# EAGLE schematic Learing_scheme (EAGLE 9.6.2)
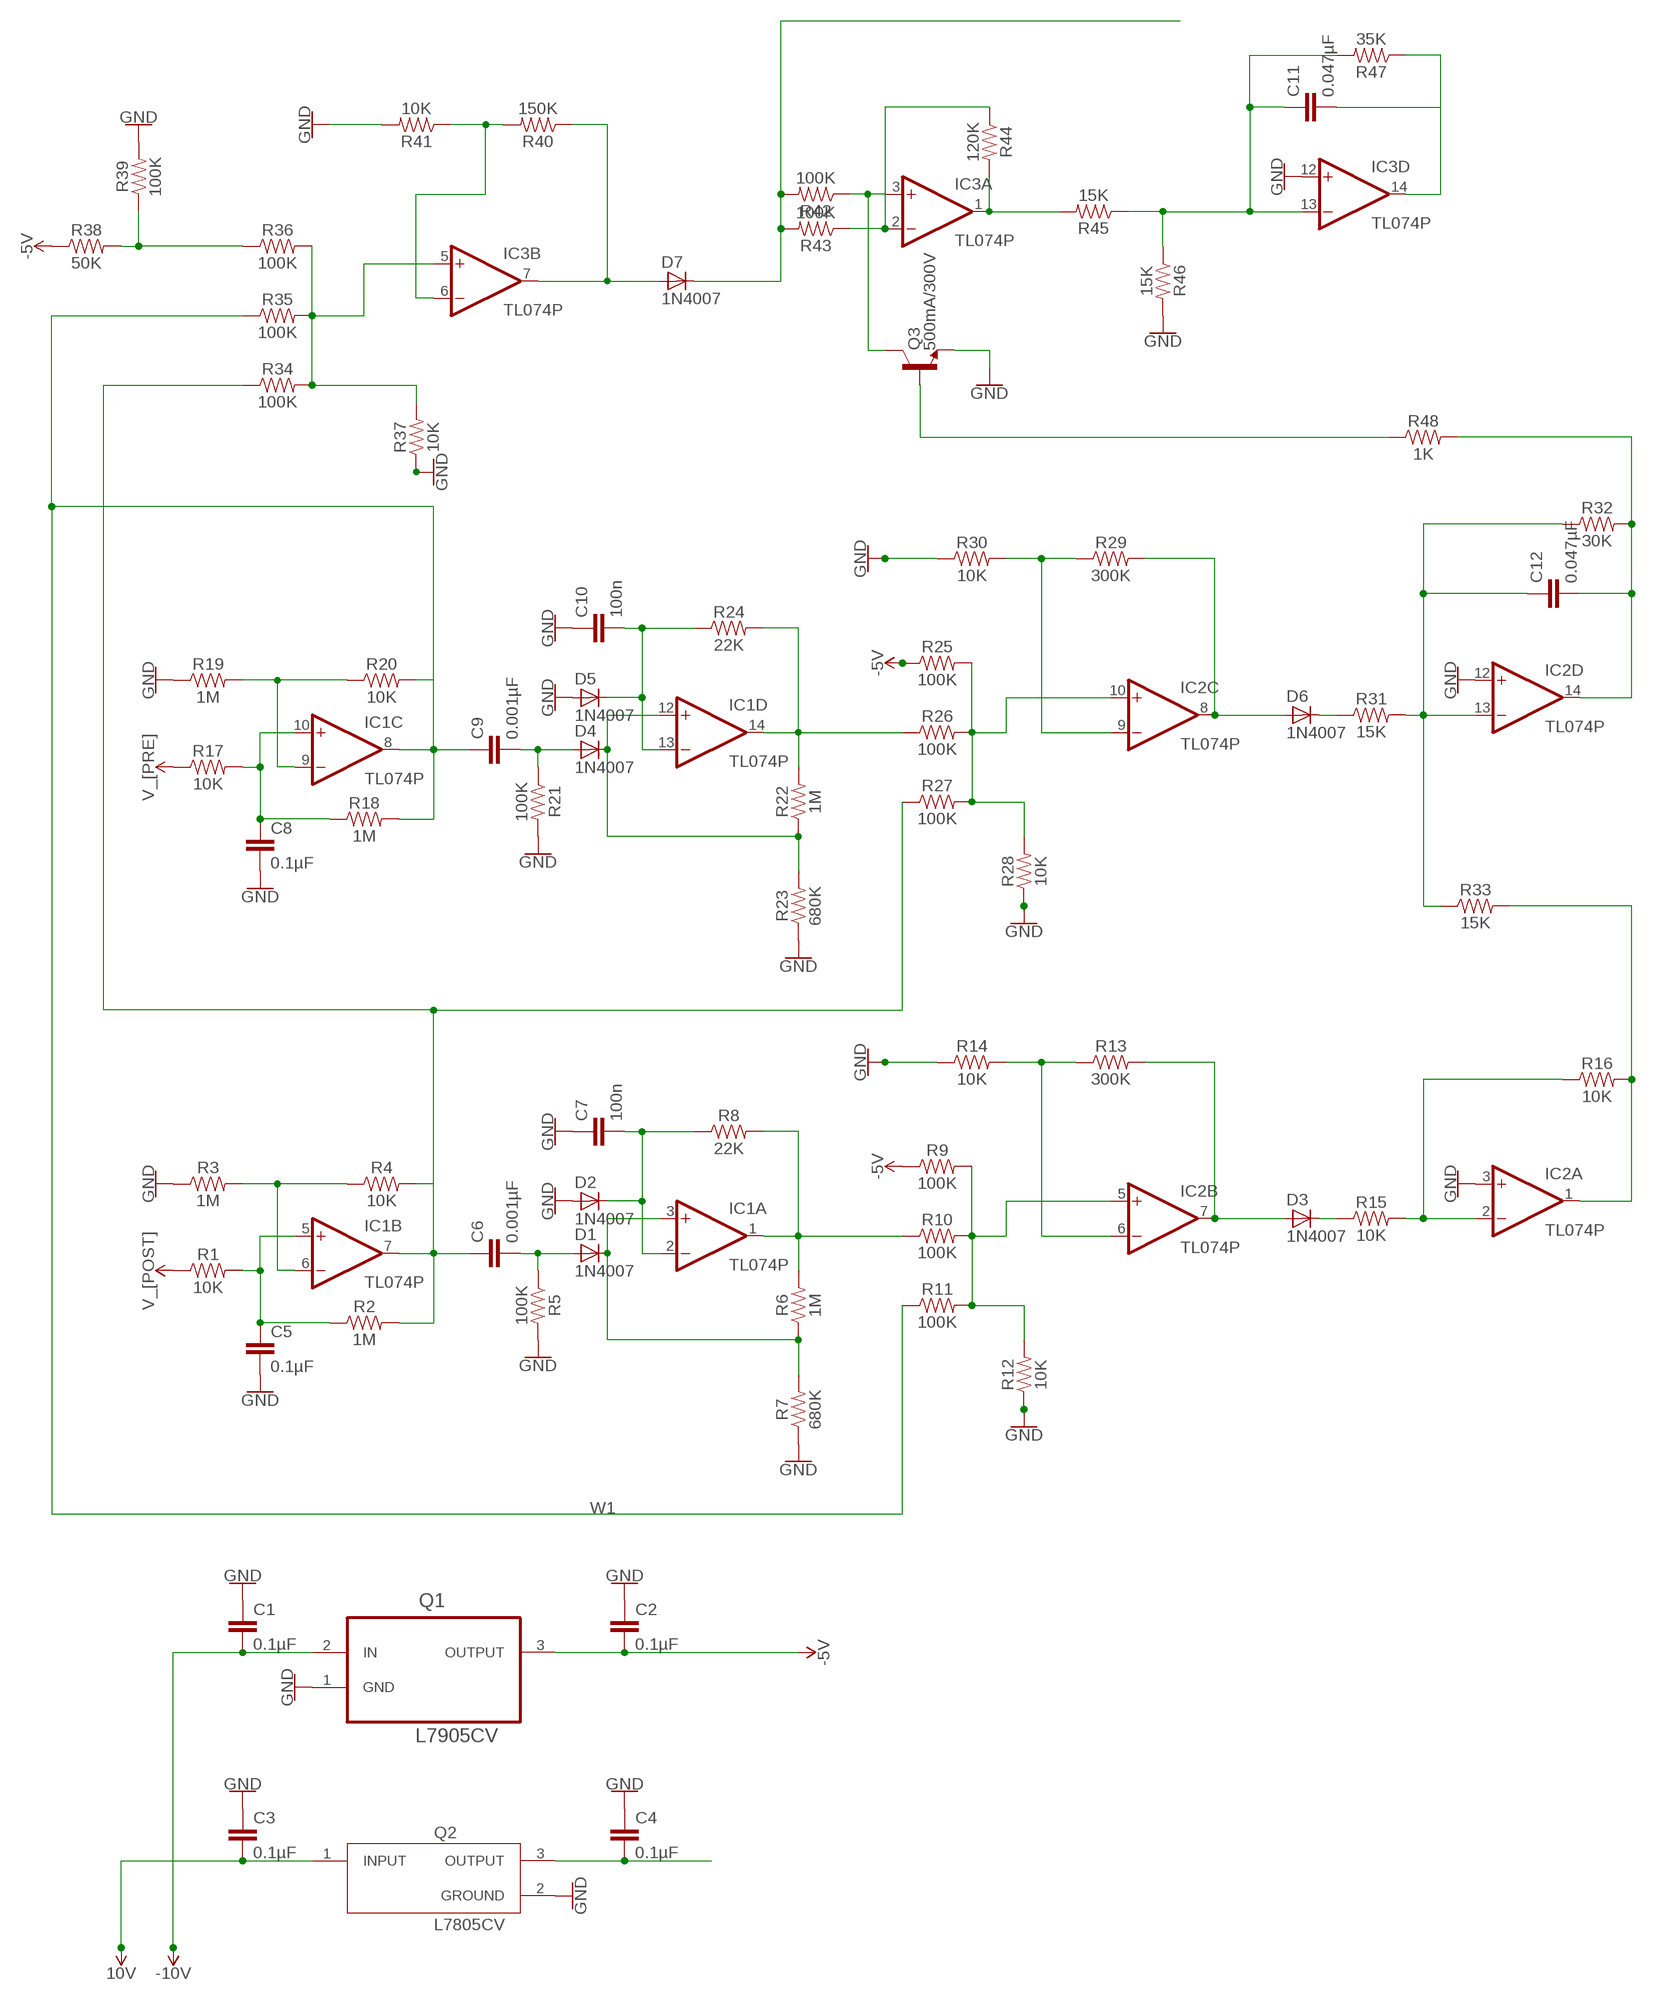
[diagram p0: schematic, sheet 1]

## Parts
C1  0.1µF  0.33UF/330NF-0805-50V-10%  [0805]
C2  0.1µF  0.33UF/330NF-0805-50V-10%  [0805]
C3  0.1µF  0.33UF/330NF-0805-50V-10%  [0805]
C4  0.1µF  0.33UF/330NF-0805-50V-10%  [0805]
C5  0.1µF  0.33UF/330NF-0805-50V-10%  [0805]
C6  0.001µF  0.33UF/330NF-0805-50V-10%  [0805]
C7  100n  0.33UF/330NF-0805-50V-10%  [0805]
C8  0.1µF  0.33UF/330NF-0805-50V-10%  [0805]
C9  0.001µF  0.33UF/330NF-0805-50V-10%  [0805]
C10  100n  0.33UF/330NF-0805-50V-10%  [0805]
C11  0.047µF  0.33UF/330NF-0805-50V-10%  [0805]
C12  0.047µF  0.33UF/330NF-0805-50V-10%  [0805]
D1  1N4007  [SMA]
D2  1N4007  [SMA]
D3  1N4007  [SMA]
D4  1N4007  [SMA]
D5  1N4007  [SMA]
D6  1N4007  [SMA]
D7  1N4007  [SMA]
IC1  TL074P  [DIL14]
IC2  TL074P  [DIL14]
IC3  TL074P  [DIL14]
Q1  L7905CV  [TO254P450X1020X1935-3P]
Q2  L7805CV  [TO255P1040X460X1968-3]
Q3  500mA/300V  TRANS_NPN-MMBTA42  [SOT23-3]
R1  10K  0.22OHM-0805-1/4W-1%  [0805]
R2  1M  0.22OHM-0805-1/4W-1%  [0805]
R3  1M  0.22OHM-0805-1/4W-1%  [0805]
R4  10K  0.22OHM-0805-1/4W-1%  [0805]
R5  100K  0.22OHM-0805-1/4W-1%  [0805]
R6  1M  0.22OHM-0805-1/4W-1%  [0805]
R7  680K  0.22OHM-0805-1/4W-1%  [0805]
R8  22K  0.22OHM-0805-1/4W-1%  [0805]
R9  100K  0.22OHM-0805-1/4W-1%  [0805]
R10  100K  0.22OHM-0805-1/4W-1%  [0805]
R11  100K  0.22OHM-0805-1/4W-1%  [0805]
R12  10K  0.22OHM-0805-1/4W-1%  [0805]
R13  300K  0.22OHM-0805-1/4W-1%  [0805]
R14  10K  0.22OHM-0805-1/4W-1%  [0805]
R15  10K  0.22OHM-0805-1/4W-1%  [0805]
R16  10K  0.22OHM-0805-1/4W-1%  [0805]
R17  10K  0.22OHM-0805-1/4W-1%  [0805]
R18  1M  0.22OHM-0805-1/4W-1%  [0805]
R19  1M  0.22OHM-0805-1/4W-1%  [0805]
R20  10K  0.22OHM-0805-1/4W-1%  [0805]
R21  100K  0.22OHM-0805-1/4W-1%  [0805]
R22  1M  0.22OHM-0805-1/4W-1%  [0805]
R23  680K  0.22OHM-0805-1/4W-1%  [0805]
R24  22K  0.22OHM-0805-1/4W-1%  [0805]
R25  100K  0.22OHM-0805-1/4W-1%  [0805]
R26  100K  0.22OHM-0805-1/4W-1%  [0805]
R27  100K  0.22OHM-0805-1/4W-1%  [0805]
R28  10K  0.22OHM-0805-1/4W-1%  [0805]
R29  300K  0.22OHM-0805-1/4W-1%  [0805]
R30  10K  0.22OHM-0805-1/4W-1%  [0805]
R31  15K  0.22OHM-0805-1/4W-1%  [0805]
R32  30K  0.22OHM-0805-1/4W-1%  [0805]
R33  15K  0.22OHM-0805-1/4W-1%  [0805]
R34  100K  0.22OHM-0805-1/4W-1%  [0805]
R35  100K  0.22OHM-0805-1/4W-1%  [0805]
R36  100K  0.22OHM-0805-1/4W-1%  [0805]
R37  10K  0.22OHM-0805-1/4W-1%  [0805]
R38  50K  0.22OHM-0805-1/4W-1%  [0805]
R39  100K  0.22OHM-0805-1/4W-1%  [0805]
R40  150K  0.22OHM-0805-1/4W-1%  [0805]
R41  10K  0.22OHM-0805-1/4W-1%  [0805]
R42  100K  0.22OHM-0805-1/4W-1%  [0805]
R43  100K  0.22OHM-0805-1/4W-1%  [0805]
R44  120K  0.22OHM-0805-1/4W-1%  [0805]
R45  15K  0.22OHM-0805-1/4W-1%  [0805]
R46  15K  0.22OHM-0805-1/4W-1%  [0805]
R47  35K  0.22OHM-0805-1/4W-1%  [0805]
R48  1K  0.22OHM-0805-1/4W-1%  [0805]

## Nets
12V: C1.2 C2.2 C3.2 Q1.2(IN) Q1.3(OUTPUT) Q2.1(INPUT) R1.1 R9.1 R17.1 R25.1 R38.1 ; supply symbol labelled 10V, -10V, V_[POST], -5V, V_[PRE]
GND: C1.1 C2.1 C3.1 C4.1 C5.2 C7.1 C8.2 C10.1 D2.A D5.A IC2.3(A:+IN) IC2.12(D:+IN) IC3.12(D:+IN) Q1.1(GND) Q2.2(GROUND) Q3.2(E) R3.1 R5.2 R7.1 R12.1 R19.1 R21.2 R23.1 R28.1 R37.1 R39.2 R41.2 R46.2
N$1: C5.1 IC1.5(B:+IN) R1.2 R2.1
N$2: C6.1 IC1.7(B:OUT) R2.2 R4.2 R27.1 R34.1
N$3: IC1.6(B:-IN) R3.2 R4.1
N$4: C4.2 Q2.3(OUTPUT)
N$5: D7.A IC3.7(B:OUT) R40.1
N$6: C6.2 D1.A R5.1
N$7: C7.2 D2.K(C) IC1.2(A:-IN) R8.1
N$8: IC1.1(A:OUT) R6.2 R8.2 R10.1
N$9: D1.K(C) IC1.3(A:+IN) R6.1 R7.2
N$10: IC2.5(B:+IN) R9.2 R10.2 R11.2 R12.2
N$11: D3.A IC2.7(B:OUT) R13.2
N$12: IC2.6(B:-IN) R13.1 R14.2
N$13: R14.1
N$14: D3.K(C) R15.1
N$15: IC2.2(A:-IN) R15.2 R16.1
N$16: IC2.1(A:OUT) R16.2 R33.2
N$17: C8.1 IC1.10(C:+IN) R17.2 R18.1
N$18: IC3.5(B:+IN) R34.2 R35.2 R36.2 R37.2
N$19: IC1.9(C:-IN) R19.2 R20.1
N$20: C9.2 D4.A R21.1
N$21: IC1.14(D:OUT) R22.2 R24.2 R26.1
N$22: D4.K(C) IC1.12(D:+IN) R22.1 R23.2
N$23: C10.2 D5.K(C) IC1.13(D:-IN) R24.1
N$24: IC2.10(C:+IN) R25.2 R26.2 R27.2 R28.2
N$25: D6.A IC2.8(C:OUT) R29.2
N$26: IC2.9(C:-IN) R29.1 R30.2
N$27: R30.1
N$28: D6.K(C) R31.1
N$29: C12.1 IC2.13(D:-IN) R31.2 R32.1 R33.1
N$30: C12.2 IC2.14(D:OUT) R32.2 R48.2
N$31: R36.1 R38.2 R39.1
N$32: IC3.6(B:-IN) R40.2 R41.1
N$33: IC3.3(A:+IN) Q3.3(C) R42.1
N$34: D7.K(C) R42.2 R43.2
N$35: IC3.2(A:-IN) R43.1 R44.1
N$36: IC3.1(A:OUT) R44.2 R45.2
N$37: C11.2 IC3.14(D:OUT) R47.1
N$39: C11.1 IC3.13(D:-IN) R45.1 R46.1 R47.2
N$40: Q3.1(B) R48.1
W1: C9.1 IC1.8(C:OUT) R11.1 R18.2 R20.2 R35.1
Unconnected: IC3.8(C:OUT) IC3.9(C:-IN) IC3.10(C:+IN)

## Power pins joined to a net without a drawn wire
V+: IC1.4(P:V+) IC2.4(P:V+) IC3.4(P:V+)
V-: IC1.11(P:V-) IC2.11(P:V-) IC3.11(P:V-)

## Library data of the parts
C1-C12 = SparkFun-Capacitors:0.33UF/330NF: 0.33µF/330nF ceramic capacitors A capacitor is a passive two-terminal electrical component used to store electrical energy temporarily in an electric field.; PROD_ID: CAP-08469; VALUE: 0.33µF
D1-D7 = casovac:1N4007
IC1-IC3 = linear3:TL074: OP AMP
Q1 = L7905CV:L7905CV: 2 % negative voltage regulators Check prices <https://pricing.snapeda.com/parts/L7905CV/STMicroelectronics/view-part?ref=eda>; AVAILABILITY: Warning; DESCRIPTION: Linear Voltage Regulator IC 1 Output 1.5A TO-220; MF: STMicroelectronics; MP: L7905CV; PACKAGE: TO-220 STMicroelectronics; PRICE: None; PURCHASE-URL: https://pricing.snapeda.com/search/part/L7905CV/?ref=eda
Q2 = L7805CV:L7805CV: Standard Regulator Pos 5V 1.5A 3-Pin(3+Tab) TO-220 Standard Regulator Pos 5V 1.5A 3-Pin(3+Tab) TO-220 Check prices <https://pricing.snapeda.com/parts/L7805CV/STMicroelectronics/view-part?ref=eda>; AVAILABILITY: Good; DESCRIPTION: Linear Voltage Regulator IC 1 Output 1.5A TO-220; MF: STMicroelectronics; MP: L7805CV; PACKAGE: TO-220 STMicroelectronics; PRICE: None; PURCHASE-URL: https://pricing.snapeda.com/search/part/L7805CV/?ref=eda
Q3 = SparkFun-DiscreteSemi:TRANS_NPN: NPN transistor Current controlled devices typically used to amplify current or used as a switch. BC547 - COM-08928 <http://www.sparkfun.com/products/8928> (TO-92 45V 100mA) (1.Collector 2.Base 3.Emitter) 2N3904 - COM-00521 <http://www.sparkfun.com/products/521> (TO-92 40V 200mA) (1.Emitter 2.Base 3.Collector) P2N2222A - COM-12852 <http://www.sparkfun.com/products/12852> (TO-92 40V 600mA) (1.Collector 2.Base 3.Emitter); PROD_ID: TRANS-09116
R1-R48 = SparkFun-Resistors:0.22OHM: 0.22Ω resistor A resistor is a passive two-terminal electrical component that implements electrical resistance as a circuit element. Resistors act to reduce current flow, and, at the same time, act to lower voltage levels within circuits. - Wikipedia; PROD_ID: RES-09883; VALUE: 0.22